# EAGLE schematic covid-respirator-ProtoB (EAGLE 7.3.0)
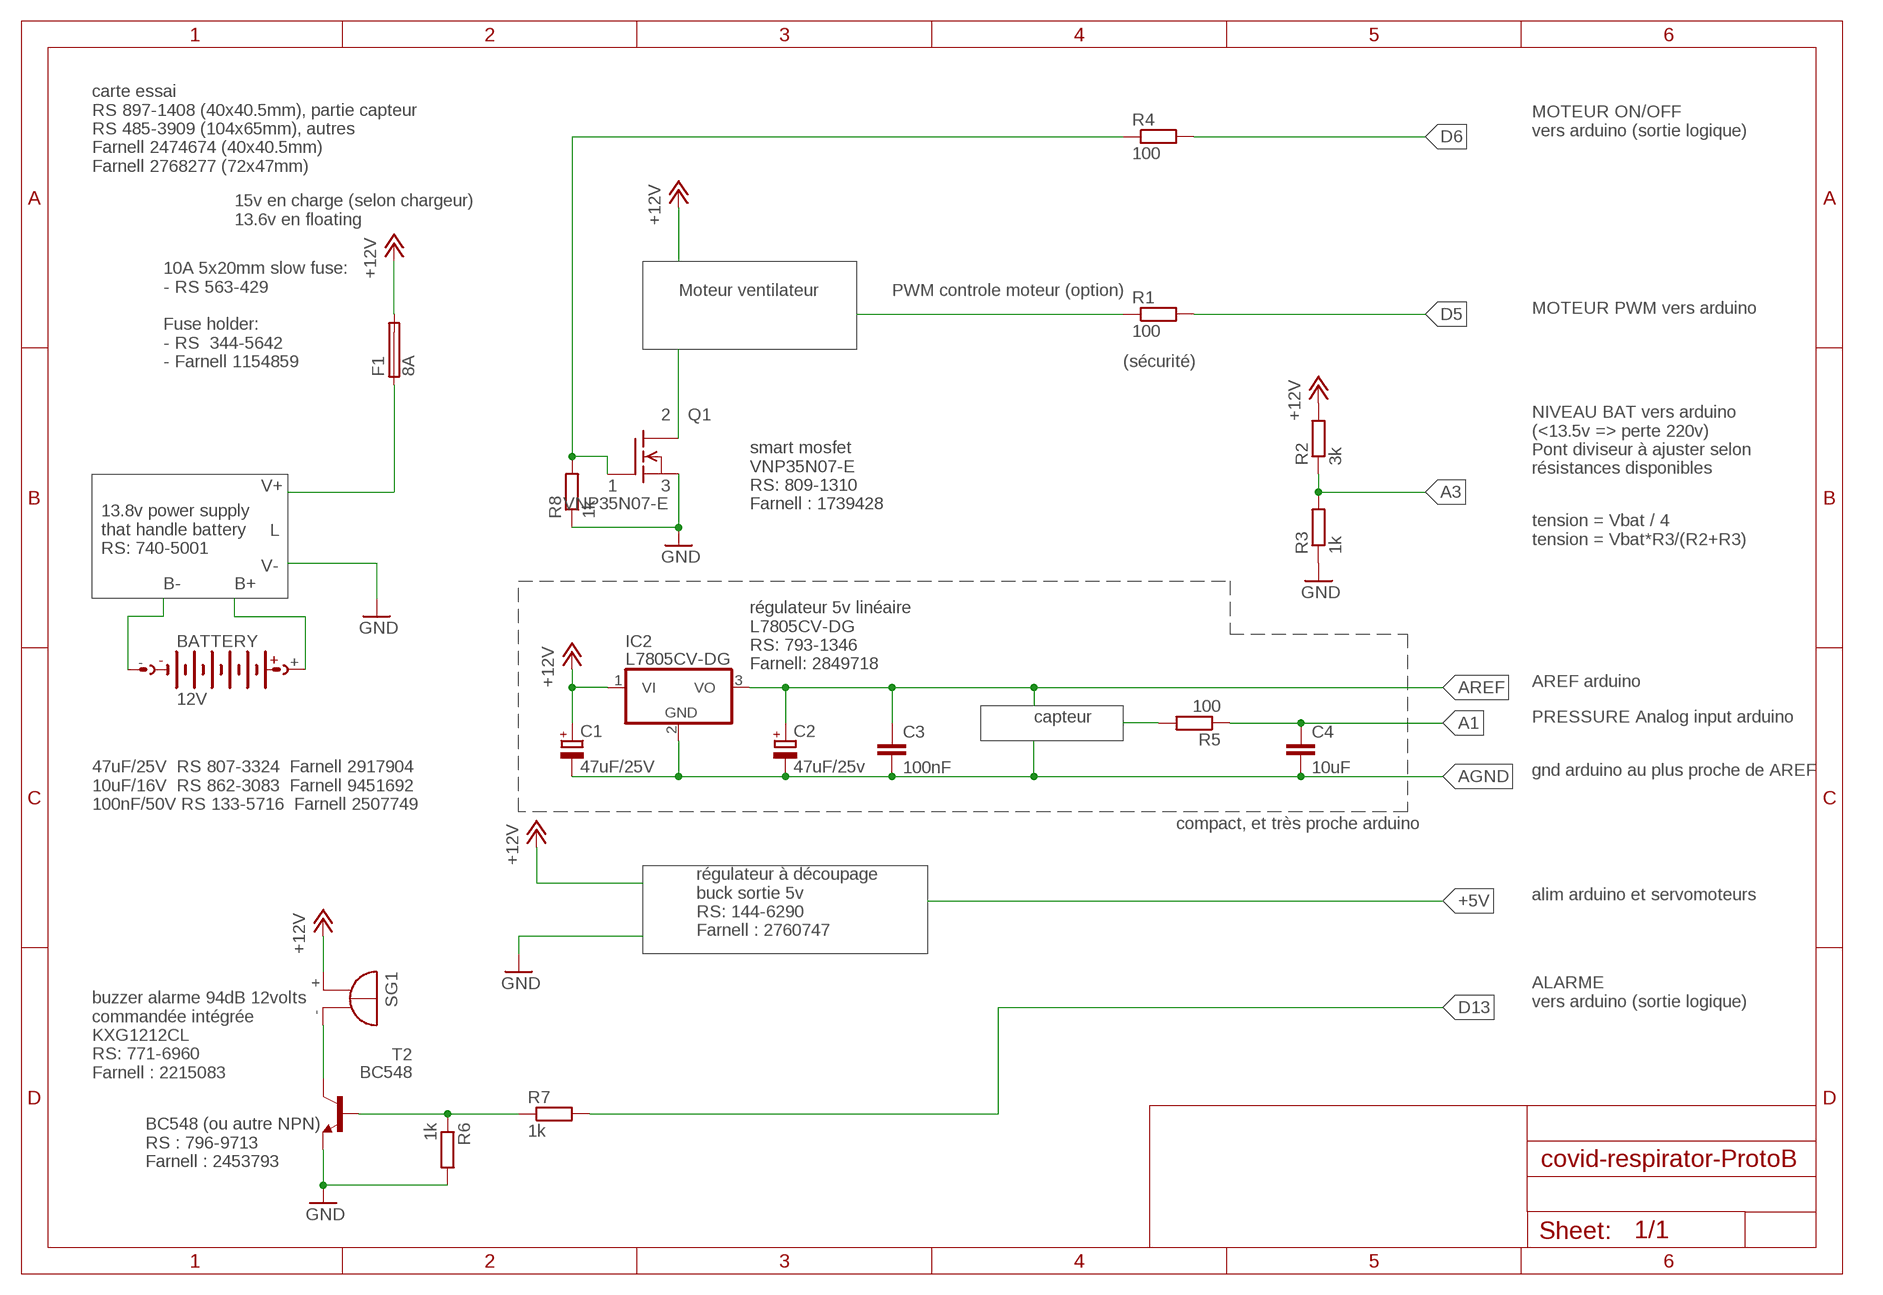
[diagram p0: schematic, sheet 1]

## Parts
BATTERY  12V  AB9V  [AB9V]
C1  47uF/25V  CPOL-EU150CLZ-1010  [150CLZ-1010]
C2  47uF/25v  CPOL-EU150CLZ-1010  [150CLZ-1010]
C3  100nF  C-EU050-050X075  [C050-050X075]
C4  10uF  C-EU050-050X075  [C050-050X075]
F1  8A  19560  [19560]
IC2  L7805CV-DG  7805T  [TO220H]
Q1  VNP35N07-E  BUZ72  [TO220]
R1  100  R-EU_0207/10  [0207/10]
R2  3k  R-EU_0207/10  [0207/10]
R3  1k  R-EU_0207/10  [0207/10]
R4  100  R-EU_0207/10  [0207/10]
R5  100  R-EU_0207/10  [0207/10]
R6  1k  R-EU_0207/10  [0207/10]
R7  1k  R-EU_0207/10  [0207/10]
R8  1k  R-EU_0207/10  [0207/10]
SG1  F/EB20P  [F/EB20P]
T2  BC548  BC548-NPN-TO92-CBE  [TO92-CBE]

## Nets
+12V: C1.+ F1.2 IC2.1(VI) R2.2 SG1.+
A1: C4.1 R5.1
A3: R2.1 R3.2
AGND: C1.- C2.- C3.2 C4.2 IC2.2(GND)
AREF: C2.+ C3.1 IC2.3(VO)
D5: R1.2
D6: R4.2
D13: R7.2
GND: Q1.3(S) R3.1 R6.2 R8.1 T2.E
N$1: R1.1
N$2: BATTERY.-
N$3: BATTERY.+
N$4: Q1.2(D)
N$5: F1.1
N$6: Q1.1(G) R4.1 R8.2
N$9: R5.2
N$12: SG1.- T2.C
N$13: R6.1 R7.1 T2.B

## Notes on the sheet
- MOTEUR ON/OFF
  vers arduino (sortie logique)
- carte essai
  RS 897-1408 (40x40.5mm), partie capteur
  RS 485-3909 (104x65mm), autres
  Farnell 2474674 (40x40.5mm)
  Farnell 2768277 (72x47mm)
- 15v en charge (selon chargeur)
  13.6v en floating
- Moteur ventilateur | PWM controle moteur (option)
- MOTEUR PWM vers arduino
- 10A 5x20mm slow fuse:
  - RS 563-429
  
  Fuse holder:
  - RS  344-5642
  - Farnell 1154859
- (sécurité)
- 2
- NIVEAU BAT vers arduino
  (<13.5v => perte 220v)
  Pont diviseur à ajuster selon 
  résistances disponibles
- V+ | 1 | 3
- smart mosfet
  VNP35N07-E
  RS: 809-1310
  Farnell : 1739428
- L
- tension = Vbat / 4
  tension = Vbat*R3/(R2+R3)
- 13.8v power supply
  that handle battery
  RS: 740-5001
- V-
- B- | B+
- régulateur 5v linéaire
  L7805CV-DG
  RS: 793-1346
  Farnell: 2849718
- AREF arduino
- capteur | PRESSURE Analog input arduino
- gnd arduino au plus proche de AREF
- compact, et très proche arduino
- 47uF/25V  RS 807-3324  Farnell 2917904
  10uF/16V  RS 862-3083  Farnell 9451692
  100nF/50V RS 133-5716  Farnell 2507749
- alim arduino et servomoteurs
- régulateur à découpage
  buck sortie 5v
  RS: 144-6290
  Farnell : 2760747
- ALARME
  vers arduino (sortie logique)
- buzzer alarme 94dB 12volts
  commandée intégrée
  KXG1212CL
  RS: 771-6960
  Farnell : 2215083
- BC548 (ou autre NPN)
  RS : 796-9713
  Farnell : 2453793

## Library data of the parts
BATTERY = battery:AB9V: 9-V BATTERY CLIP
C1 C2 = rcl:CPOL-EU: POLARIZED CAPACITOR, European symbol
C3 C4 = rcl:C-EU: CAPACITOR, European symbol
F1 = fuse:19560: FUSE HOLDER TR5, Wickmann; MPN: 56000001009; OC_FARNELL: 1185363; OC_NEWARK: 15P8392
IC2 = linear:78*: Positive VOLTAGE REGULATOR Source: http://cache.national.com/ds/LM/LM78L05.pdf http://www.fairchildsemi.com/ds/LM/LM7805.pdf
Q1 = transistor-fet:BUZ72: N-Channel Enhancement MOSFET 100V; 10A; 0,2Ohm
R1-R8 = rcl:R-EU_: RESISTOR, European symbol
SG1 = buzzer:F/EB20P: BUZZER Source: Buerklin; OC_FARNELL: unknown; OC_NEWARK: unknown
T2 = transistor:*-NPN-: NPN Transistror BF959 corrected 2008.03.06